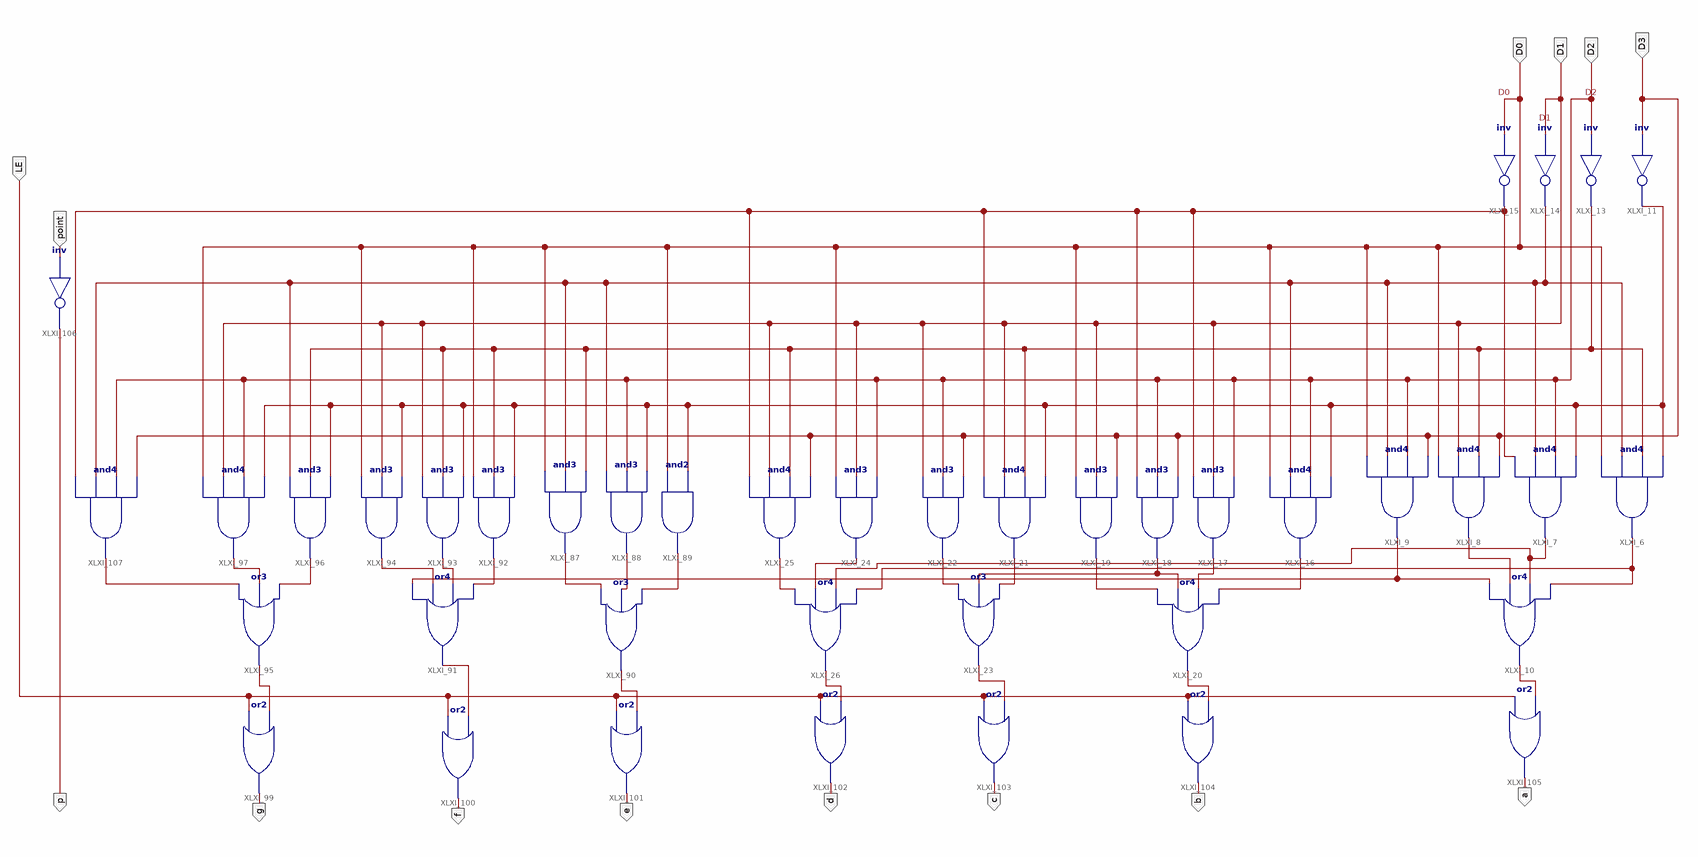
[diagram p0: schematic sheet 1]
// Xilinx ISE schematic MC14495_sch.sch (kintex7) as structural Verilog: 40 symbols, 14 ports
module MC14495_sch (
  input  D2,
  input  D1,
  input  D0,
  input  LE,
  input  point,
  input  D3,
  output p,
  output g,
  output f,
  output e,
  output d,
  output c,
  output b,
  output a
);

  wire _D0, _D1, _D2, _D3, XLXN_16, XLXN_17, XLXN_19, XLXN_20, XLXN_21, XLXN_22, XLXN_23, XLXN_24, XLXN_27,
       XLXN_28, XLXN_29, XLXN_31, XLXN_107, XLXN_108, XLXN_110, XLXN_117, XLXN_119, XLXN_120, XLXN_121,
       XLXN_122, XLXN_133, XLXN_134, XLXN_135, XLXN_136, XLXN_137, XLXN_138, XLXN_139, XLXN_147;

  and XLXI_6 (XLXN_19, D0, _D1, _D2, _D3);
  and XLXI_8 (XLXN_17, D0, D1, _D2, D3);
  and XLXI_9 (XLXN_16, D0, _D1, D2, D3);
  or XLXI_10 (XLXN_133, XLXN_16, XLXN_17, XLXN_31, XLXN_19);
  not XLXI_11 (_D3, D3);
  not XLXI_13 (_D2, D2);
  not XLXI_14 (_D1, D1);
  not XLXI_15 (_D0, D0);
  and XLXI_7 (XLXN_31, _D0, _D1, D2, _D3);
  and XLXI_16 (XLXN_23, D0, _D1, D2, _D3);
  and XLXI_17 (XLXN_22, _D0, D1, D2);
  and XLXI_18 (XLXN_21, _D0, D2, D3);
  and XLXI_19 (XLXN_20, D0, D1, D3);
  or XLXI_20 (XLXN_134, XLXN_20, XLXN_21, XLXN_22, XLXN_23);
  and XLXI_21 (XLXN_27, _D0, D1, _D2, _D3);
  and XLXI_22 (XLXN_24, D1, D2, D3);
  or XLXI_23 (XLXN_135, XLXN_24, XLXN_21, XLXN_27);
  and XLXI_24 (XLXN_29, D0, D1, D2);
  and XLXI_25 (XLXN_28, _D0, D1, _D2, D3);
  or XLXI_26 (XLXN_136, XLXN_28, XLXN_29, XLXN_31, XLXN_19);
  and XLXI_87 (XLXN_110, D0, _D1, _D2);
  and XLXI_88 (XLXN_108, _D1, D2, _D3);
  and XLXI_89 (XLXN_107, D0, _D3);
  or XLXI_90 (XLXN_137, XLXN_110, XLXN_108, XLXN_107);
  or XLXI_91 (XLXN_138, XLXN_16, XLXN_117, XLXN_119, XLXN_120);
  and XLXI_92 (XLXN_120, D0, _D2, _D3);
  and XLXI_93 (XLXN_119, D1, _D2, _D3);
  and XLXI_94 (XLXN_117, D0, D1, _D3);
  or XLXI_95 (XLXN_139, XLXN_147, XLXN_122, XLXN_121);
  and XLXI_96 (XLXN_121, _D1, _D2, _D3);
  and XLXI_97 (XLXN_122, D0, D1, D2, _D3);
  or XLXI_99 (g, LE, XLXN_139);
  or XLXI_100 (f, LE, XLXN_138);
  or XLXI_101 (e, LE, XLXN_137);
  or XLXI_102 (d, LE, XLXN_136);
  or XLXI_103 (c, LE, XLXN_135);
  or XLXI_104 (b, LE, XLXN_134);
  or XLXI_105 (a, LE, XLXN_133);
  not XLXI_106 (p, point);
  and XLXI_107 (XLXN_147, _D0, _D1, D2, D3);
endmodule
